# EAGLE schematic Flicker_Fusion (EAGLE 7.5.0)
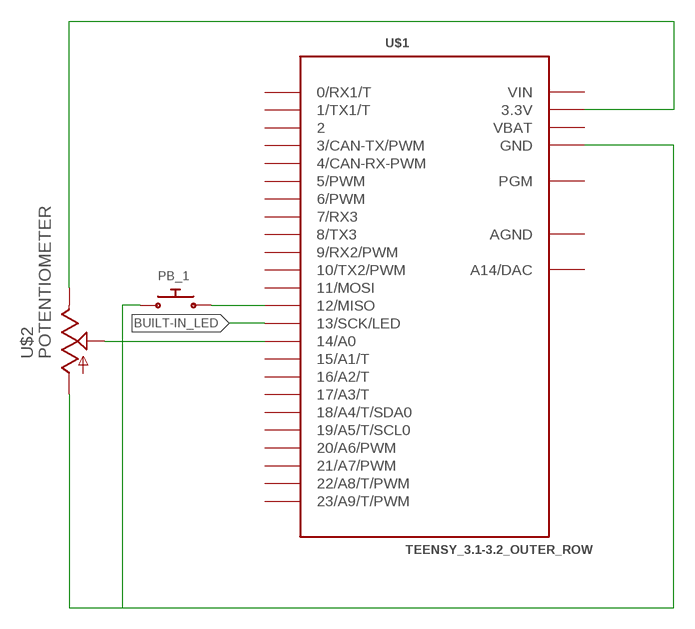
[diagram p0: schematic, sheet 1]

## Parts
PB_1  PUSH_BUTTON_RCTNG  [PB_DIP_RCTNG_3-WIDE]
U$1  TEENSY_3.1-3.2_OUTER_ROW  [TEENSY_3.0-3.2&LC_OUTER_ROW]
U$2  POTENTIOMETER  [POTENTIOMETER]

## Nets
BUILT-IN_LED: U$1.13(13/SCK/LED)
N$1: PB_1.2 U$1.12(12/MISO)
N$2: PB_1.1 U$1.GND U$1.GND1(GND) U$2.+(-)
N$3: U$1.3.3V U$1.3.3V1(3.3V) U$2.-(+)
N$5: U$1.14/A0 U$2.DATA
Unconnected: U$1.0(0/RX1/T) U$1.1(1/TX1/T) U$1.2 U$1.3(3/CAN-TX/PWM) U$1.4(4/CAN-RX-PWM) U$1.5(5/PWM) U$1.6(6/PWM) U$1.7(7/RX3) U$1.8(8/TX3) U$1.9(9/RX2/PWM) U$1.10(10/TX2/PWM) U$1.11(11/MOSI) U$1.15/A1(15/A1/T) U$1.16/A2(16/A2/T) U$1.17/A3(17/A3/T) U$1.18/A4(18/A4/T/SDA0) U$1.19/A5(19/A5/T/SCL0) U$1.20/A6(20/A6/PWM) U$1.21/A7(21/A7/PWM) U$1.22/A8(22/A8/T/PWM) U$1.23/A9(23/A9/T/PWM) U$1.PGM U$1.RESET/DAC(A14/DAC)

## Power pins joined to a net without a drawn wire
AGND: U$1.AGND
VBAT: U$1.VBAT
VIN: U$1.VIN

## Library data of the parts
PB_1 = Generic:PUSH_BUTTON
U$1 = Teensy_3_and_LC_Series_Boards_v1.4:TEENSY_3.1-3.2_OUTER_ROW: Footprint for Teensy 3.1 or 3.2 board using all pin connections on the outer perimeter
U$2 = Generic:POTENTIOMETER